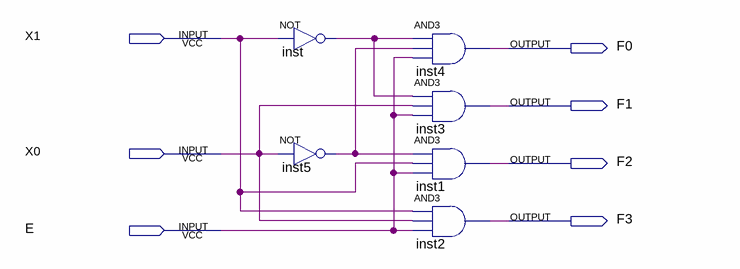
[diagram p0: schematic sheet]
// Quartus schematic DEMUX_SCH.bdf as structural Verilog: 6 symbols, 7 pins
module DEMUX_SCH (
  input  X1,
  input  X0,
  input  E,
  output F0,
  output F1,
  output F2,
  output F3
);

  wire inst5_out, inst_out;

  not inst (inst_out, X1);
  not inst5 (inst5_out, X0);
  and inst4 (F0, inst_out, inst5_out, E);
  and inst3 (F1, inst_out, X0, E);
  and inst1 (F2, inst5_out, X1, E);
  and inst2 (F3, X1, X0, E);
endmodule
